# Altium schematic sheet Toplevel.SchDoc: Toplevel
size A3; Author: Borja Serra; CompanyName: Blueye Robotics; Organization: Blueye Robotics AS; Address1: Transittgata 10; Address2: 7042 Trondheim; Address3: Norway; Revision: 0; SheetNumber: 1; SheetTotal: 3
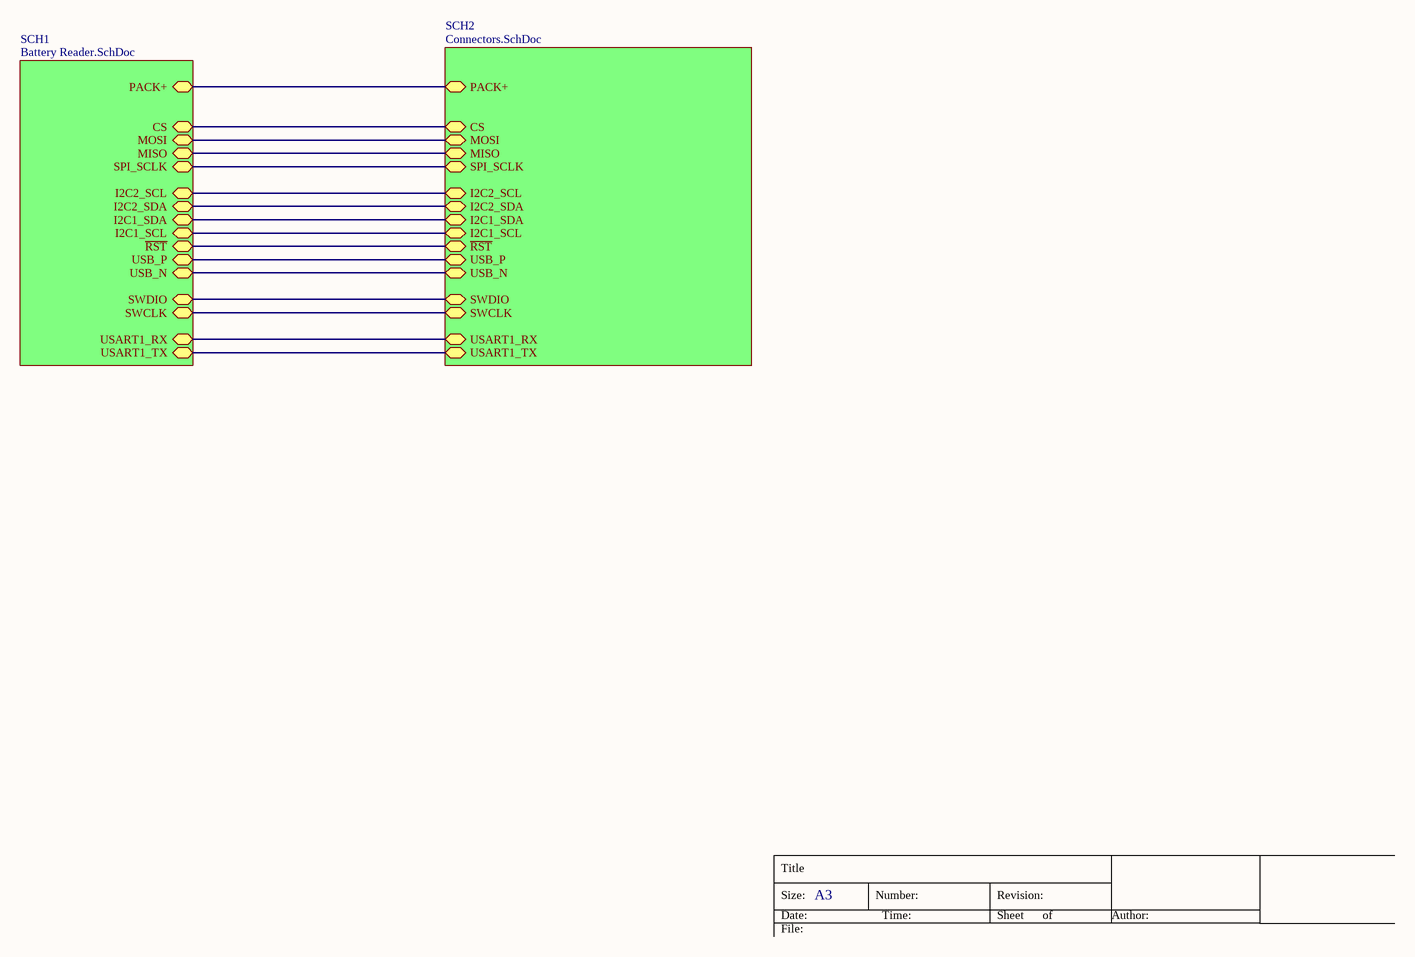
[diagram p0: Toplevel.SchDoc]

## Sub-sheets
SCH1 = Battery Reader.SchDoc: CS, ~{RST}, MOSI, MISO, SPI_SCLK, USB_P, USB_N, I2C1_SDA, I2C1_SCL, PACK+, SWDIO, USART1_RX, SWCLK, USART1_TX, I2C2_SCL, I2C2_SDA
SCH2 = Connectors.SchDoc: CS, MISO, USB_P, MOSI, SPI_SCLK, I2C1_SCL, I2C1_SDA, ~{RST}, USB_N, PACK+, SWDIO, USART1_TX, USART1_RX, SWCLK, I2C2_SCL, I2C2_SDA

## Nets
(unnamed): sheet SCH1/CS, sheet SCH2/CS
(unnamed): sheet SCH1/~{RST}, sheet SCH2/~{RST}
(unnamed): sheet SCH1/MOSI, sheet SCH2/MOSI
(unnamed): sheet SCH1/MISO, sheet SCH2/MISO
(unnamed): sheet SCH1/SPI_SCLK, sheet SCH2/SPI_SCLK
(unnamed): sheet SCH1/USB_P, sheet SCH2/USB_P
(unnamed): sheet SCH1/USB_N, sheet SCH2/USB_N
(unnamed): sheet SCH1/I2C1_SDA, sheet SCH2/I2C1_SDA
(unnamed): sheet SCH1/I2C1_SCL, sheet SCH2/I2C1_SCL
(unnamed): sheet SCH1/PACK+, sheet SCH2/PACK+
(unnamed): sheet SCH1/SWDIO, sheet SCH2/SWDIO
(unnamed): sheet SCH1/USART1_RX, sheet SCH2/USART1_RX
(unnamed): sheet SCH1/SWCLK, sheet SCH2/SWCLK
(unnamed): sheet SCH1/USART1_TX, sheet SCH2/USART1_TX
(unnamed): sheet SCH1/I2C2_SCL, sheet SCH2/I2C2_SCL
(unnamed): sheet SCH1/I2C2_SDA, sheet SCH2/I2C2_SDA

## Notes on the sheet
- Title
- Size:
- Date:
- A3
- Number:
- Time:
- Revision:
- Sheet
- of
- Author:
- File: